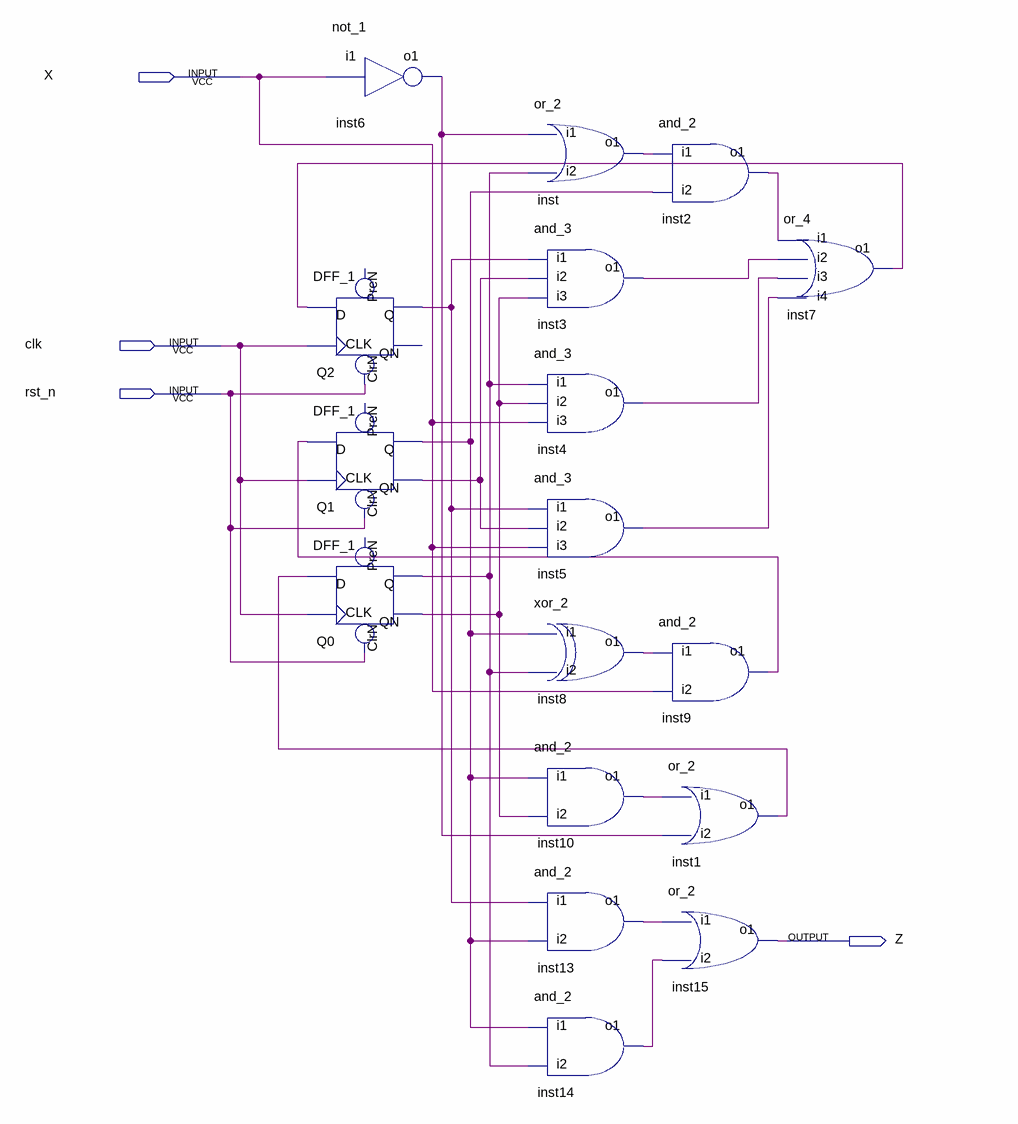
[diagram p0: schematic sheet]
// Quartus schematic SD.bdf as structural Verilog: 17 symbols, 4 pins
module SD (
  input  X,
  input  clk,
  input  rst_n,
  output Z
);

  wire inst1_o1, inst2_o1, inst3_o1, inst4_o1, inst5_o1, inst6_o1, inst7_o1, inst8_o1, inst9_o1, inst10_o1,
       inst13_o1, inst14_o1, inst_o1, Q0_q, Q0_qn, Q1_q, Q1_qn, Q2_q;

  DFF_1 Q2 (.CLK(clk), .D(inst7_o1), .ClrN(rst_n), .Q(Q2_q));  // open: PreN, QN
  DFF_1 Q1 (.CLK(clk), .D(inst9_o1), .ClrN(rst_n), .QN(Q1_qn), .Q(Q1_q));  // open: PreN
  DFF_1 Q0 (.CLK(clk), .D(inst1_o1), .ClrN(rst_n), .QN(Q0_qn), .Q(Q0_q));  // open: PreN
  not_1 inst6 (.i1(X), .o1(inst6_o1));
  or_2 inst (.i1(inst6_o1), .i2(Q0_q), .o1(inst_o1));
  and_3 inst3 (.i1(Q2_q), .i2(Q1_qn), .i3(Q0_qn), .o1(inst3_o1));
  and_3 inst4 (.i1(Q0_q), .i2(Q0_qn), .i3(X), .o1(inst4_o1));
  and_3 inst5 (.i1(Q2_q), .i2(Q1_qn), .i3(X), .o1(inst5_o1));
  xor_2 inst8 (.i1(Q1_q), .i2(Q0_q), .o1(inst8_o1));
  and_2 inst10 (.i1(Q1_q), .i2(Q0_qn), .o1(inst10_o1));
  and_2 inst13 (.i1(Q2_q), .i2(Q1_q), .o1(inst13_o1));
  and_2 inst14 (.i1(Q1_q), .i2(Q0_q), .o1(inst14_o1));
  and_2 inst2 (.i1(inst_o1), .i2(Q1_q), .o1(inst2_o1));
  and_2 inst9 (.i1(inst8_o1), .i2(X), .o1(inst9_o1));
  or_2 inst1 (.i1(inst10_o1), .i2(inst6_o1), .o1(inst1_o1));
  or_2 inst15 (.i1(inst13_o1), .i2(inst14_o1), .o1(Z));
  or_4 inst7 (.i1(inst2_o1), .i2(inst3_o1), .i3(inst4_o1), .i4(inst5_o1), .o1(inst7_o1));
endmodule
